# EAGLE schematic piezo-preamp-tickler_V0-9b (EAGLE 8.0.0)
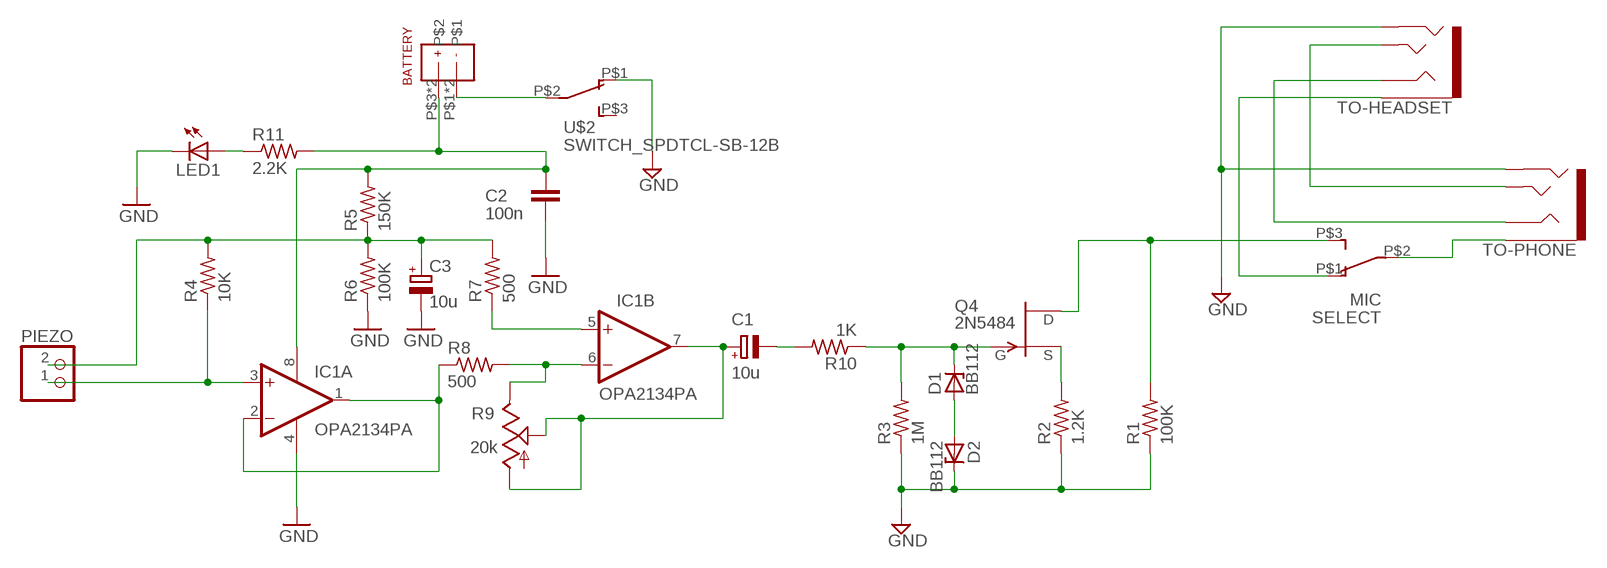
[diagram p0: schematic, sheet 1]

## Parts
BATTERY  BATTERY-A27  [BATTERY-A27-KEYSTONE-3651]
C1  10u  CPOL-EUTT2D5L  [TT2D5L]
C2  100n  C-EU025-025X050  [C025-025X050]
C3  10u  CPOL-EUTT2D5L  [TT2D5L]
D1  BB112  ZENER-DIODEZD-5  [ZDIO-5]
D2  BB112  ZENER-DIODEZD-5  [ZDIO-5]
IC1  OPA2134PA  [DIL08]
LED1  LED3MM  [LED3MM]
PIEZO  JST_2PIN-THM  [JST-PH-2-THM]
Q4  2N5484  [TO92-]
R1  100K  R-US_0204/7  [0204/7]
R2  1.2K  R-US_0204/7  [0204/7]
R3  1M  R-US_0204/7  [0204/7]
R4  10K  R-US_0204/7  [0204/7]
R5  150K  R-US_0204/7  [0204/7]
R6  100K  R-US_0204/7  [0204/7]
R7  500  R-US_0204/7  [0204/7]
R8  500  R-US_0204/7  [0204/7]
R9  20k  TRIMPOT-BOURNS  [TRIMPOT-BOURNS-3306F]
R10  1K  R-US_0204/7  [0204/7]
R11  2.2K  R-US_0204/7  [0204/7]
SELECT  MIC  SWITCH_SPDTCL-SB-12B  [SWITCH_SPDT_CL-SB-12B]
TO-HEADSET  AUDIO-JACK3LGPADS  [AUDIO-JACK-TRRS-SMD]
TO-PHONE  AUDIO-JACK3LGPADS  [AUDIO-JACK-TRRS-SMD]
U$2  SWITCH_SPDTCL-SB-12B  [SWITCH_SPDT_CL-SB-12B]

## Nets
GND: C2.1 C3.- D2.C IC1.4(A:V-) LED1.K(C) R1.1 R2.1 R3.1 R6.1 TO-HEADSET.RING2 TO-PHONE.RING2 U$2.P$1
N$1: D1.A D2.A
N$2: BATTERY.P$1 BATTERY.P$2 U$2.P$2
N$3: Q4.2(S) R2.2
N$5: IC1.5(B:+IN) R7.1
N$6: C1.+ IC1.7(B:OUT) R9.P$1(IN) R9.P$2(WIPER)
N$7: IC1.6(B:-IN) R8.2 R9.P$3(OUT)
N$8: C3.+ PIEZO.2 R4.2 R5.1 R6.2 R7.2
N$9: IC1.3(A:+IN) PIEZO.1 R4.1
N$10: D1.C Q4.1(G) R3.2 R10.1
N$11: C1.- R10.2
N$12: SELECT.P$1 TO-HEADSET.EARTH
N$13: TO-HEADSET.TIP TO-PHONE.TIP
N$14: IC1.1(A:OUT) IC1.2(A:-IN) R8.1
N$15: TO-HEADSET.RING1 TO-PHONE.RING1
N$16: LED1.A R11.1
N$17: SELECT.P$2 TO-PHONE.EARTH
SELECT: Q4.3(D) R1.2 SELECT.P$3
V9V: BATTERY.P$3 BATTERY.P$4 C2.2 IC1.8(A:V+) R5.2 R11.2
Unconnected: U$2.P$3

## Library data of the parts
BATTERY = CMU-ArtFab:BATTERY-A27
C1 C3 = rcl:CPOL-EU: POLARIZED CAPACITOR, European symbol
C2 = rcl:C-EU: CAPACITOR, European symbol
D1 D2 = diode:ZENER-DIODE: Z-Diode
IC1 = linear:OPA2*: Dual Operational Amplifier Low Power, Single-Supply, Rail-To-Rail Operational Amplifier Source: http://focus.ti.com/lit/ds/symlink/opa2345.pdf http://focus.ti.com .. opa241.pdf http://focus.ti.com/lit/ds/symlink/opa2134.pdf
LED1 = led:LED: LED OSRAM: - CHIPLED LG R971, LG N971, LY N971, LG Q971, LY Q971, LO R971, LY R971 LH N974, LH R974 LS Q976, LO Q976, LY Q976 LO Q996 - Hyper CHIPLED LW Q18S LB Q993, LB Q99A, LB R99A - SideLED LS A670, LO A670, LY A670, LG A670, LP A670 LB A673, LV A673, LT A673, LW A673 LH A674 LY A675 LS A676, LA A676, LO A676, LY A676, LW A676 LS A679, LY A679, LG A679 - Hyper Micro SIDELED® LS Y876, LA Y876, LO Y876, LY Y876 LT Y87S - SmartLED LW L88C, LW L88S LB L89C, LB L89S, LG L890 LS L89K, LO L89K, LY L89K LS L896, LA L896, LO L896, LY L896 - TOPLED LS T670, LO T670, LY T670, LG T670, LP T670 LSG T670, LSP T670, LSY T670, LOP T670, LYG T670 LG T671, LOG T671, LSG T671 LB T673, LV T673, LT T673, LW T673 LH T674 LS T676, LA T676, LO T676, LY T676, LB T676, LH T676, LSB T676, LW T676 LB T67C, LV T67C, LT T67C, LS T67K, LO T67K, LY T67K, LW E67C LS E67B, LA E67B, LO E67B, LY E67B, LB E67C, LV E67C, LT E67C LW T67C LS T679, LY T679, LG T679 LS T770, LO T770, LY T770, LG T770, LP T770 LB T773, LV T773, LT T773, LW T773 LH T774 LS E675, LA E675, LY E675, LS T675 LS T776, LA T776, LO T776, LY T776, LB T776 LHGB T686 LT T68C, LB T68C - Hyper Mini TOPLED® LB M676 - Mini TOPLED Santana® LG M470 LS M47K, LO M47K, LY M47K Source: http://www.osram.convergy.de LUXEON: - LUMILED® LXK2-PW12-R00, LXK2-PW12-S00, LXK2-PW14-U00, LXK2-PW14-V00 LXK2-PM12-R00, LXK2-PM12-S00, LXK2-PM14-U00 LXK2-PE12-Q00, LXK2-PE12-R00, LXK2-PE12-S00, LXK2-PE14-T00, LXK2-PE14-U00 LXK2-PB12-K00, LXK2-PB12-L00, LXK2-PB12-M00, LXK2-PB14-N00, LXK2-PB14-P00, LXK2-PB14-Q00 LXK2-PR12-L00, LXK2-PR12-M00, LXK2-PR14-Q00, LXK2-PR14-R00 LXK2-PD12-Q00, LXK2-PD12-R00, LXK2-PD12-S00 LXK2-PH12-R00, LXK2-PH12-S00 LXK2-PL12-P00, LXK2-PL12-Q00, LXK2-PL12-R00 Source: www.luxeon.com KINGBRIGHT: KA-3528ASYC Source: www.kingbright.com
PIEZO = adafruit:JST_2PIN: JST 2-Pin Connectors of various flavors SMT-RA (S2B-PH-SM4) 4UConnector #17311 SMT (B2B-PH-SM4) THM-RA (S2B-PH) THM (B2B-PH)
Q4 = transistor-fet:?548*: N-Channel JFETs Source: VISHAY 2N5484.pdf Compatible: TO92 2N5245 J304 J305 U310 J308 J309 J310 TO72 2N4416 2N4416A 2N3823 2N4351 3N169 3N170 3N171 MFE3002 TO18 2N3796 2N3797 MFE825 Source: Motorola European Master Guide Pacge 3-59
R1-R8 R10 R11 = CMU-ArtFab:R-US_: RESISTOR, American symbol
R9 = CMU-ArtFab:TRIMPOT-BOURNS
SELECT U$2 = CMU-ArtFab:SWITCH_SPDT
TO-HEADSET TO-PHONE = Daniel:AUDIO-JACK3: Audio jack - 3.5mm TRRS variety - two rings.

## Net classes
0 default: width 0.152 mm, clearance 0.2 mm